# Altium project Siron_charger.PrjPcb
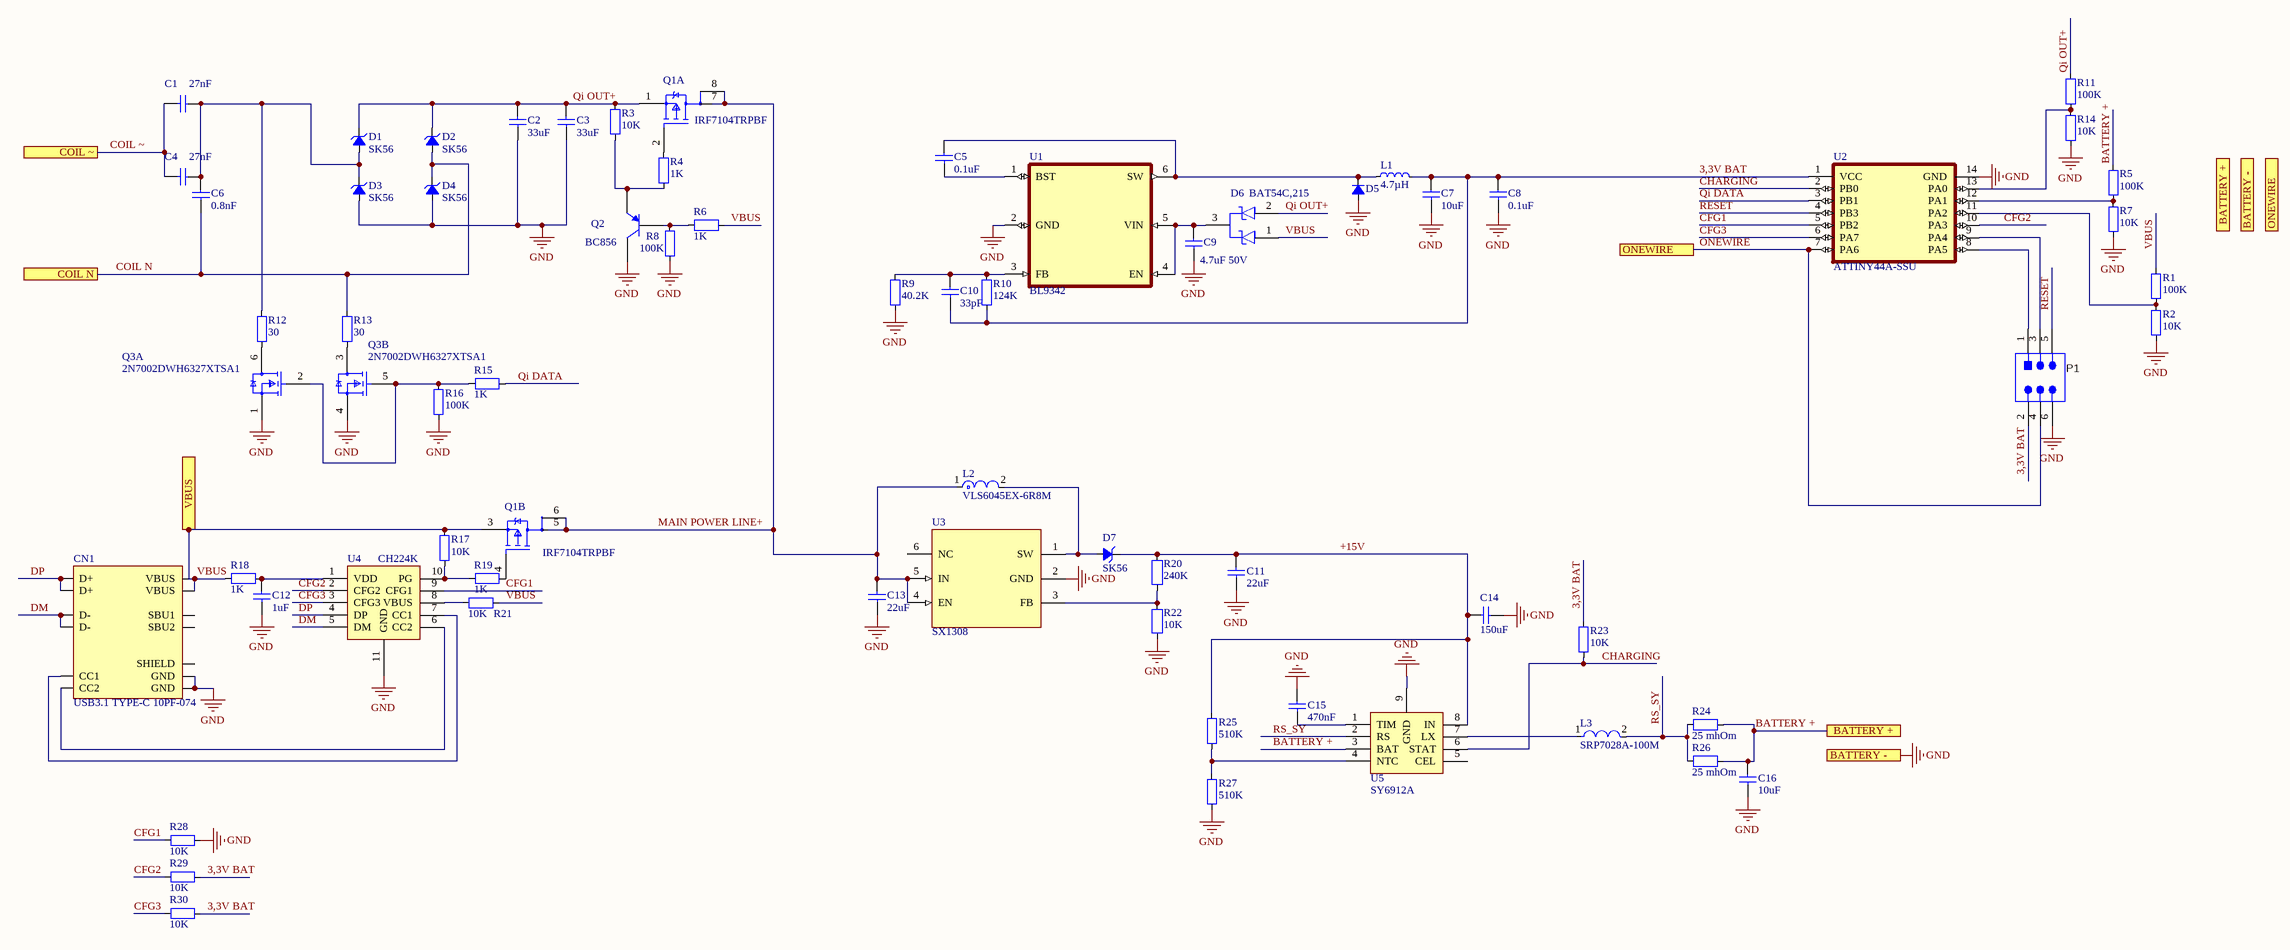
[diagram p0: Charging_PCB.SchDoc]
1 sheet, 66 parts. Net scope: flat (ports and power ports of the same name join across sheets).
Board file: Charging_PCB.PcbDoc

## Sheet Charging_PCB.SchDoc
size A2; Organization: Altium Limited; Address1: L3, 12a Rodborough Rd; Address2: Frenchs Forest; Address3: NSW; Address4: Australia 2086

### Parts
C1  27nF  [1206]
C2  33uF  [1206]
C3  33uF  [1206]
C4  27nF  [1206]
C5  0.1uF  [R0603]
C6  0.8nF  [1206]
C7  10uF  [C0805]
C8  0.1uF  [R0603]
C9  4.7uF 50V  [C0805]
C10  33pF  [R0603]
C11  22uF  [1206]
C12  1uF  [C0805]
C13  22uF  [1206]
C14  150uF  [1206]
C15  470nF  [R0603]
C16  10uF  [1206]
CN1  USB3.1 TYPE-C 10PF-074  [USB3.1 TYPE-C 10PF-074]
D1  SK56  [DO-214AA(SMB)]
D2  SK56  [DO-214AA(SMB)]
D3  SK56  [DO-214AA(SMB)]
D4  SK56  [DO-214AA(SMB)]
D5  (no value)  [SOD-123]
D6  BAT54C,215  [SOT-23]
D7  SK56  [DO-214AA(SMB)]
L1  4.7µH  [INDC1608X06L]
L2  VLS6045EX-6R8M  [FP-VLS6045EX-100M-MFG]
L3  SRP7028A-100M  [INDUCT_7028]
P1  TSW-103-07-G-D  [SMTC-TSW-103-07-G-D_V]  (value not drawn)
Q1  IRF7104TRPBF  [SO8]  (parts A,B of 2)
Q2  BC856  [SOT-23]
Q3  2N7002DWH6327XTSA1  [SOT363-IPC_A]  (parts A,B of 2)
R1  100K  [R0603]
R2  10K  [R0603]
R3  10K  [R0603]
R4  1K  [R0603]
R5  100K  [R0603]
R6  1K  [R0603]
R7  10K  [R0603]
R8  100K  [R0603]
R9  40.2K  [R0603]
R10  124K  [R0603]
R11  100K  [R0603]
R12  30  [R0603]
R13  30  [R0603]
R14  10K  [R0603]
R15  1K  [R0603]
R16  100K  [R0603]
R17  10K  [R0603]
R18  1K  [R0603]
R19  1K  [R0603]
R20  240K  [R0603]
R21  10K  [R0603]
R22  10K  [R0603]
R23  10K  [R0603]
R24  25 mhOm  [1206]
R25  510K  [R0603]
R26  25 mhOm  [1206]
R27  510K  [R0603]
R28  10K  [R0603]
R29  10K  [R0603]
R30  10K  [R0603]
U1  BL9342  [SOT23-6]
U2  ATTINY44A-SSU  [SO14]
U3  SX1308  [SOT23-6]
U4  CH224K  [ESSOP10]
U5  SY6912A  [PSOP8]

### Ports
BATTERY +, BATTERY -, COIL N, COIL ~, ONEWIRE, VBUS

### Nets
GND: C2.2 C3.2 C7.1 C8.1 C9.1 C11.1 C12.1 C13.1 C14.2 C15.2 C16.1 CN1.1(GND) CN1.12(GND) D3.2(A) D4.2(A) D5.1(A) P1.6 Q2.3(C) Q3.1(S1) Q3.4(S2) R2.1 R7.1 R8.1 R9.1 R14.1 R16.1 R22.1 R27.2 R28.2 U1.2(GND) U2.14(GND) U3.2(GND) U4.11(GND) U5.9(GND) ; port BATTERY -
3,3V BAT: C7.2 C8.2 C10.1 L1.2 P1.2 R10.1 R23.2 R29.2 R30.2 U2.1(VCC)
+15V: C11.2 C14.1 D7.1(K) R20.1 R25.1 U5.8(IN)
BATTERY +: C16.2 R5.2 R24.2 R26.2 U5.3(BAT) ; port BATTERY +
CFG1: R28.1 U2.5(PB2) U4.9(CFG1)
CFG2: R29.1 U2.10(PA3) U4.2(CFG2)
CFG3: R30.1 U2.6(PA7) U4.3(CFG3)
CHARGING: R23.1 U2.2(PB0) U5.6(STAT)
COIL N: C6.2 D2.2(A) D4.1(K) R13.2 ; port COIL N
COIL ~: C1.2 C4.2 ; port COIL ~
DM: CN1.6(D-) CN1.9(D-) U4.5(DM)
DP: CN1.4(D+) CN1.7(D+) U4.4(DP)
MAIN POWER LINE+: C13.2 L2.1 Q1.5(D2) Q1.6(D2) Q1.7(D1) Q1.8(D1) U3.4(EN) U3.5(IN)
ONEWIRE: P1.4 U2.7(PA6) ; port ONEWIRE
Qi DATA: R15.2 U2.3(PB1)
Qi OUT+: C2.1 C3.1 D1.1(K) D2.1(K) D6.2(2_ANODE) Q1.1(S1) R3.2 R11.2
RESET: P1.5 U2.4(PB3)
RS_SY: L3.2 R24.1 R26.1 U5.2(RS)
VBUS: CN1.3(VBUS) CN1.10(VBUS) D6.1(1_ANODE) Q1.3(S2) R1.2 R6.2 R17.2 R18.1 R21.2 ; port VBUS
NetC1_1: C1.1 C4.1 C6.1 D1.2(A) D3.1(K) R12.2
NetC5_1: C5.1 U1.1(BST)
NetC5_2: C5.2 D5.2(K) L1.1 U1.6(SW)
NetC9_2: C9.2 D6.3(COMMON_CATHODE) U1.4(EN) U1.5(VIN)
NetC10_2: C10.2 R9.2 R10.2 U1.3(FB)
NetC12_2: C12.2 R18.2 U4.1(VDD)
NetC15_1: C15.1 U5.1(TIM)
NetCN1_2: CN1.2(CC1) U4.7(CC1)
NetCN1_8: CN1.8(CC2) U4.6(CC2)
NetD7_2: D7.2(A) L2.2 U3.1(SW)
NetL3_1: L3.1 U5.7(LX)
NetP1_1: P1.1 U2.8(PA5)
NetP1_3: P1.3 U2.9(PA4)
NetQ1_2: Q1.2(G1) R4.2
NetQ1_4: Q1.4(G2) R19.2
NetQ2_1: Q2.1(B) R6.1 R8.2
NetQ2_2: Q2.2(E) R3.1 R4.1
NetQ3_2: Q3.2(G1) Q3.5(G2) R15.1 R16.2
NetQ3_3: Q3.3(D2) R13.1
NetQ3_6: Q3.6(D1) R12.1
NetR1_1: R1.1 R2.2 U2.11(PA2)
NetR5_1: R5.1 R7.2 U2.12(PA1)
NetR11_1: R11.1 R14.2 U2.13(PA0)
NetR17_1: R17.1 R19.1 U4.10(PG)
NetR20_2: R20.2 R22.2 U3.3(FB)
NetR21_1: R21.1 U4.8(VBUS)
NetR25_2: R25.2 R27.1 U5.4(NTC)

Not connected (* = marked no-connect by the designer): CN1 5(SBU2) 11(SBU1) MH(SHIELD); U3 6(NC); U5 5(CEL)

### Notes on the sheet
- Title
- Size:
- Date:
- File:
- A2
- Number:
- Time:
- Revision:
- Sheet
- of

### Library data of the parts
C1-C16 = CAP
  C1 C4: Value: 27nF
  C2 C3: Value: 33uF
  C5 C8: Value: 0.1uF
  C6: Value: 0.8nF
  C7 C16: Value: 10uF
  C9: Value: 4.7uF 50V
  C10: Value: 33pF
  C11 C13: Value: 22uF
  C12: Value: 1uF
  C14: Value: 150uF
  C15: Value: 470nF
CN1 = USB3.1 TYPE-C 10PF-074: XKB Connectivity USB-C Connector
D1-D4 D7 = DIODE_DO-214: DO-214 Diode; Manufacturer Part Number: China; Value: SK56
D5 = Diode_SOD123: Schottky diode SOD123; Note: Schottky diode  SOD123
D6 = BAT54C: DIODE ARRAY SCHOTTKY 30V SOT23; Manufacturer: Nexperia; Automotive Grade: Grade 0; Peak Reverse Current: 2uA; Forward Current: 200mA; Max Surge Forward Current: 600mA; Value: 10pF; Max Junction Temp: +150°C; Lead Free: Yes; Automotive: Yes; Device Class L1: Discrete Semiconductors; Digikey Description: DIODE ARRAY SCHOTTKY 30V SOT23; Reverse Voltage: 30V; ComponentLink2URL: https://assets.nexperia.com/documents/data-sheet/BAT54_SER.pdf; Device Class L2: Diodes; Category: Diode; Octopart: https://octopart.com/bat54c%2C215-nexperia-78738945; Package: SOT23; Mouser Description: Schottky Diodes, Rectifiers - Arrays SOT-23 (TO-236AB) 30V 200mA (DC) Surface Mount; RoHS: TRUE; Manufacturer Part Number: BAT54C,215; Temperature: to +150°C; Ambient Temperature Range Low: -55°C; Height: 1.1mm; Device Class L3: Schottky Diodes; Temperature Range High: +150°C; Footprint Url: https://assets.nexperia.com/documents/outline-drawing/SOT23.pdf; Capacitance: 10pF; Ambient Temperature Range High: +150°C; Ipc Land Pattern Name: SOT95P230X100-3; ComponentLink2Description: Datasheet
L1 = IND_1: Inductor, SMD; Part Number: L0603-10µ; Manufacturer: Taiyo Yuden; Manufacturer Part Number: LBMF1608T100K; Note: Inductor 10uH 10% 80mA 360mOhm 0603; Datasheet: http://www.yuden.co.jp/ut/product/pdf/elb2_e.pdf; Footprint: 0603; LatestRevisionDate: 2012-09-19; Pin Count: 2; Publisher: Nordic Semiconductor; Published: 2010-02-24; Value: 4.7µH
L2 = VLS6045EX: FIXED IND  SMD; Shielding: Shielded; Test Frequency: 100kHz; Core Material: Ferrite; Inductance Tolerance: 20%; DC Resistance (DCR): 61mR; REACH SVHC: No SVHC; Min Operating Temperature: -40°C; RoHS Compliant: Yes; Length: 0.236inch; Lead Free: Lead Free; Packaging: Cut Tape; Width: 0.236inch; Case/Package: Nonstandard; Resistor Type: Wirewound; Height - Seated (Max): 0.177inch; Mount: Surface Mount; Max Operating Temperature: 105°C; Tolerance: 20%
L3 = IND_SRP7028A: FIXED IND; Manufacturer: Panasonic; Manufacturer Part Number: ETQ-P3M2R2YFP; Tolerance: 20%; Automotive Grade: Grade 0; Standoff Height: 0.05mm; Inductance: 2.2uH; Series Resistance: 24.8mΩ; Core Material: Metal Composite; Test Frequency: 100kHz; Saturation Current: 10.9A; Rms Current: 4.8A; Shielding: true; Temperature Range Low: -40°C; Category: Ind; Temperature: -40°C to +150°C; Lead Free: Yes; Temperature Range High: +150°C; Height: 3mm; Device Class L3: Fixed Inductors; Automotive: Yes; Device Class L2: Inductors; ComponentLink2URL: https://industrial.panasonic.com/cdbs/www-data/pdf/AGL0000/AGL0000C59.pdf; ComponentLink2Description: Datasheet; Octopart: https://octopart.com/etqp3m2r2yfp-panasonic-65686337; Device Class L1: Passive Components; Digikey Description: FIXED IND 2.2UH 5.8A 24.8 MOHM; RoHS: TRUE; Package: PCC-M0530M
P1 = CMP-2000-07329-1: Through Hole Header, Pitch 2.54 mm, 2 x 3 Position, Height 8.58 mm, Tail Length 2.54 mm, -55 to 125 degC, RoHS, Bulk; Manufacturer: Samtec-Inc.; Manufacturer: Samtec; Number of Positions Loaded: All; Number of Positions: 6; Row Spacing: 0.100"(2.54mm); Connector Type: Header,Unshrouded; Package Reference: TSW-103-07-G-D; Termination: Solder; Manufacturer URL: http://www.samtec.com/; Contact Finish: Gold; Contact Mating Length: 0.230"(5.84mm); Package Description: Through Hole Header, Pitch 2.54 mm, 2 x 3 Position, Height 8.58 mm, Tail Length 2.54 mm; Datasheet Version: 12/2015; Number of Rows: 2; Features: -; Family: RectangularConnectors-Headers,MalePins; Fastening Type: -; Datasheet URL: http://suddendocs.samtec.com/catalog_english/tsw_th.pdf; Category: Connectors,Interconnects; Package URL: http://suddendocs.samtec.com/prints/tsw-xxx-xx-xxx-x-xx-xxx-mkt.pdf; Mounting Type: ThroughHole; Contact Finish Thickness: 10µin(0.25µm); Packaging: Bulk; Color: Black; Pitch: 0.100"(2.54mm); Series: TSW; Contact Type: MalePin; Mounting Technology: ThroughHole; Manufacturer Part Number: TSW-103-07-G-D
Q1 = IRF7104TRPBF: MOSFET 2P-CH 20V 2.3A 8-SOIC; Rds On Max: 250mR; Max Dual Supply Voltage: -20V; Max Power Dissipation: 2W; Gate to Source Voltage (Vgs): 12V; Input Capacitance: 290pF; Turn-On Delay Time: 12ns; Turn-Off Delay Time: 42ns; Drain to Source Resistance: 400mR; Threshold Voltage: -3V; Polarization: P; Width: 0.157inch; Case/Package: SO; Length: 0.196inch; Mount: Surface Mount; Drain to Source Voltage (Vdss): -20V; Series: HEXFET®; Min Operating Temperature: -55°C; Packaging: Cut Tape; Drain to Source Breakdown Voltage: -20V; Number of Pins: 8; Max Operating Temperature: 150°C; RoHS Compliant: Yes; Height: 0.059inch; Reach SVHC Compliant: Yes; Halogen Free: Halogen Free; Continuous Drain Current (ID): 2.3A; Power Dissipation: 2W; Lead Free: Lead Free
Q2 = BC856: PNP General Purpose Transistor, 65 V, -65 to 150 degC, 3-Pin SOT23, RoHS; Manufacturer: NXP; No. of Pins: 3; Voltage Vcbo: 80V; Power Dissipation Ptot Max: 250mW; Current Ic hFE: 2mA; Collector Emitter Voltage V(br)ceo: 65V; Hfe Min: 125; Continuous Collector Current Ic Max: 100mA; Gain Bandwidth ft Typ: 150MHz; No. of Transistors: 1; Package Version: 02/2016; SMD Marking: 3D; Gain Bandwidth ft Min: 100MHz; SVHC: NoSVHC(19-Dec-2012); Noise Factor Max: 10dB; Collector Emitter Voltage Vces: -300mV; Operating Temperature Range: -65°Cto+150°C; Datasheet URL: http://www.nxp.com/documents/data_sheet/BC856_BC857_BC858.pdf; Device Marking: BC856; Mounting Technology: SurfaceMount; Package Reference: SOT23-3; Operating Temperature Max: 150°C; Transistor Case Style: SOT-23; Package / Case: SOT-23; DC Current Gain hFE: 125; Current Ic Continuous a Max: 100mA; Power Dissipation Pd: 250mW; Manufacturer URL: http://www.nxp.com/; Termination Type: SMD; Transistor Polarity: PNP; Package URL: http://www.nxp.com/documents/outline_drawing/SOT23.pdf; DC Collector Current: 100mA; Operating Temperature Min: -65°C; Package Description: 3-Pin Small Outline Transistor, Body 1.3 x 2.9 mm, Pitch 0.95 mm; Datasheet Version: 01/2004
Q3 = WM06DN03D: MOSFET 2N-CH 60V 0.3A SOT363; Rise Time: 3.3ns; Turn-On Delay Time: 3ns; Continuous Drain Current (ID): 300mA; FET Type: 2 N-Channel; Input Capacitance: 20pF; Power Dissipation: 500mW; Number of Elements: 2; Gate to Source Voltage (Vgs): 20V; Rds On Max: 3R; Fall Time: 3.1ns; Turn-Off Delay Time: 5.5ns; Mount: Surface Mount; Lead Free: Lead Free; REACH SVHC: No SVHC; Halogen Free: Halogen Free; Drain to Source Voltage (Vdss): 60V; Packaging: Tape and Reel; Max Power Dissipation: 500mW; Number of Pins: 6; Max Dual Supply Voltage: 60V; Case/Package: SOT-363-6; Max Operating Temperature: 150°C; Min Operating Temperature: -55°C
R1-R30 = RES SMD UNI: Resistor SMD; Category: Resistors
  R1 R5 R8 R11 R16: Value: 100K
  R2 R3 R7 R14 R17 R21-R23 R28-R30: Value: 10K
  R4 R6 R15 R18 R19: Value: 1K
  R9: Value: 40.2K
  R10: Value: 124K
  R12 R13: Value: 30
  R20: Value: 240K
  R24 R26: Value: 25 mhOm
  R25 R27: Value: 510K
U1 = BL9342: MF: {'manufacturer': u'Texas Instruments'}; Package: None; MP: BL9342; Value: *; Price: None; Availability: Unavailable
U2 = ATTINY44A-SSU: MF: {'manufacturer': u'Microchip'}; Package: None; Value: *; Price: None; MP: ATTINY44A-SSU; Availability: Unavailable
U3 = SX1308: IC REG BOOST ADJ 2A TSOT23-6; Manufacturer: Suosemi; Min Output Voltage: 600mV; Switching Frequency: 500kHz; Min Input Voltage: 4.5V; Quiescent Current: 40uA; Number of Outputs: 1; Output Voltage: 26V; Max Input Voltage: 28V; Max Operating Temperature: 125°C; Max Output Voltage: 26V; Number of Pins: 6; Case/Package: SOT-6; REACH SVHC: No SVHC; Packaging: Cut Tape; Lead Free: Lead Free; Min Operating Temperature: -40°C; Output Current: 2A; Manufacturer Part Number: SX1308
U4 = CH224K: IC PD QC USB driver; Manufacturer: ST; Manufacturer Part Number: ST3485EBDR; Note: IC TXRX 3.3V RS485/422 8 SOIC